# Altium schematic sheet CH32X035F8U6-R0.SchDoc
size 304 x 254 mm
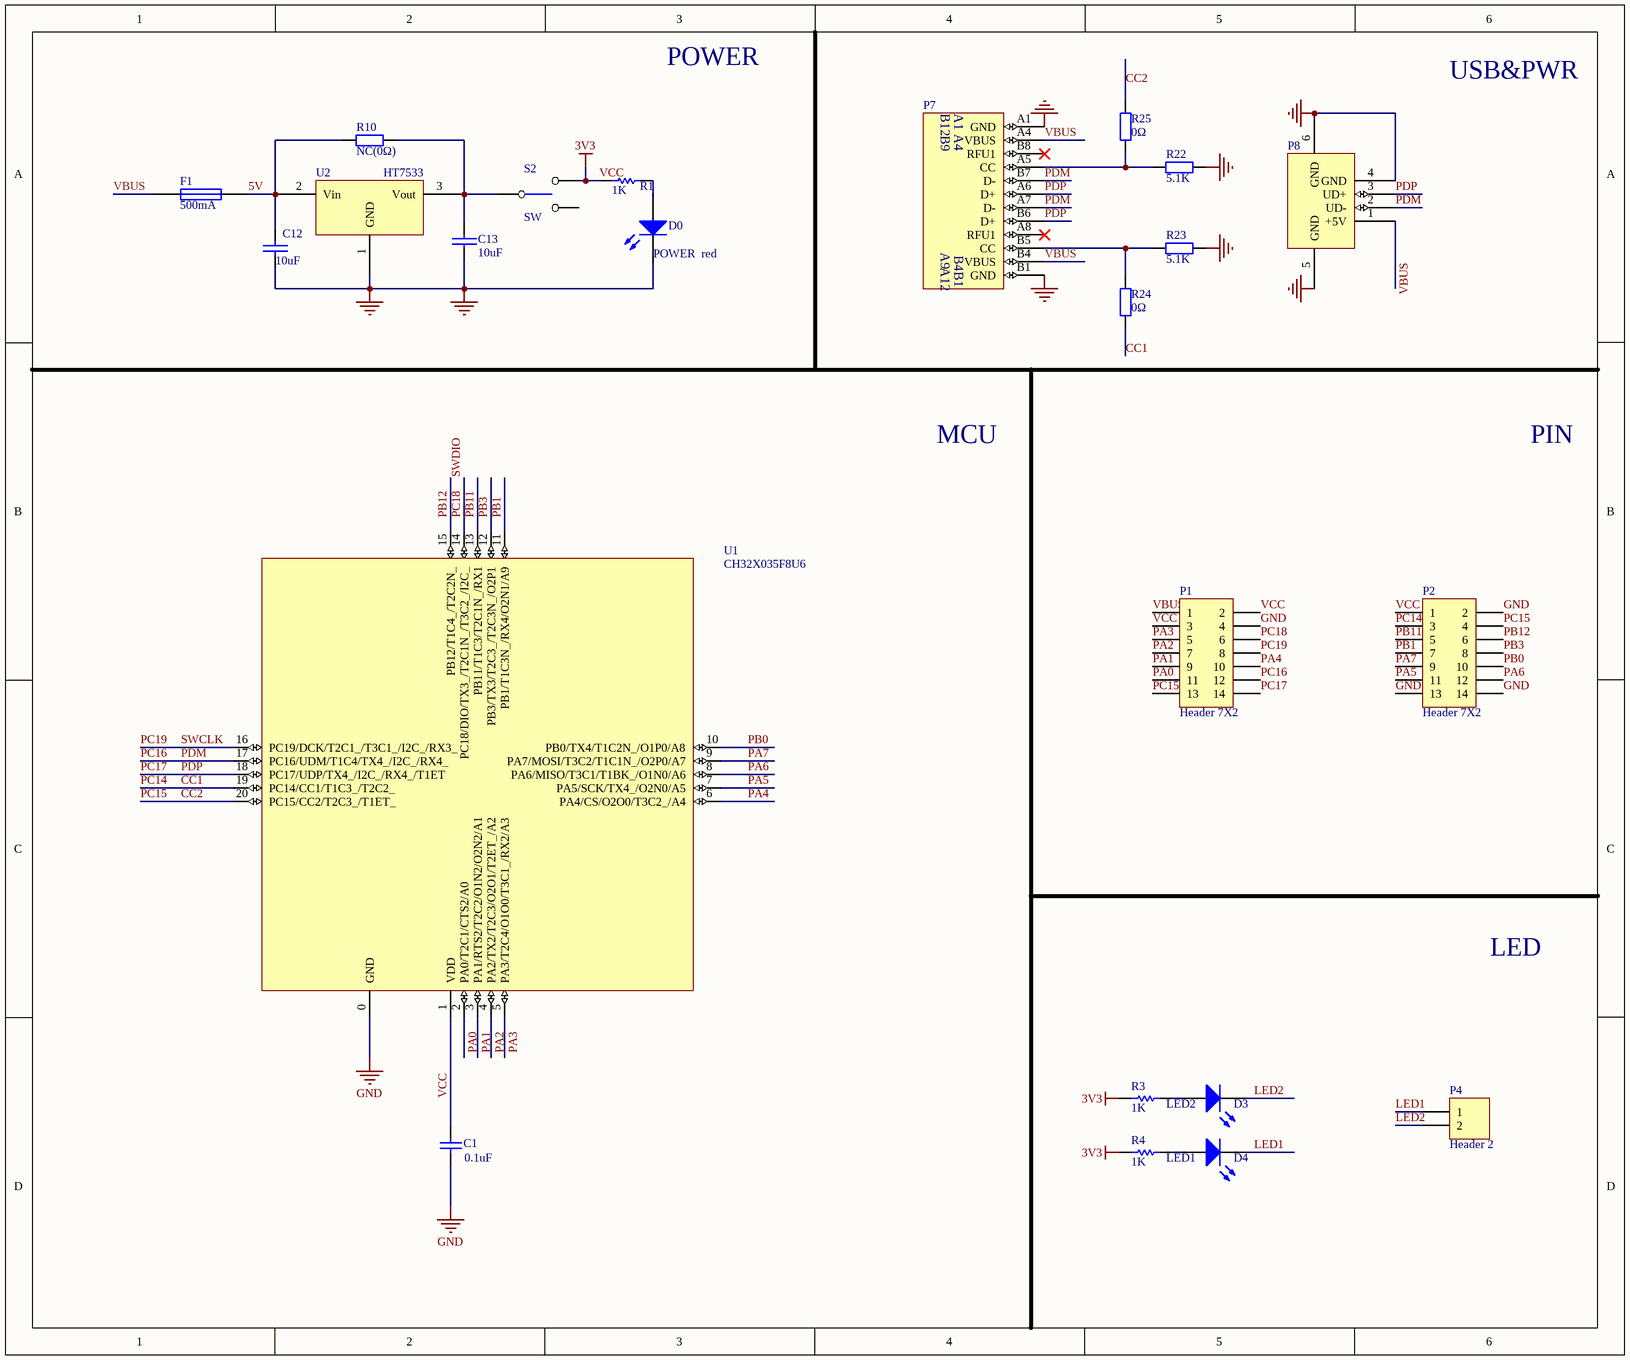
[diagram p0: CH32X035F8U6-R0.SchDoc]

## Parts
C1  0.1uF  [0603_C]
C12  10uF  [0603_C]
C13  10uF  [0603_C]
D0  POWER  red  [0603+]
D3  LED2  [0603+]
D4  LED1  [0603+]
F1  500mA  [0603]
P1  Header 7X2  [IDC14-2.54mm]
P2  Header 7X2  [IDC14-2.54mm]
P4  Header 2  [SIP2-2.54mm]
P7  TYPE-C  [TYPE-C-Receptacle-2.0]  (value not drawn)
P8  USB_A  [USBAF]  (value not drawn)
R1  1K  [0603]
R3  1K  [0603]
R4  1K  [0603]
R10  NC(0Ω)  [0603]
R22  5.1K  [0603]
R23  5.1K  [0603]
R24  0Ω  [0603]
R25  0Ω  [0603]
S2  SW  [SW1]
U1  CH32X035F8U6  [QFN20_3X3]
U2  HT7533  [SOT-89]

## Nets
GND: C1.1 C12.2 C13.2 D0.2(K) P1.4 P2.2 P2.13 P2.14 P7.A1(GND) P7.B1(GND) P8.4(GND) P8.5(GND) P8.6(GND) R22.2 R23.2 U1.0(GND) U2.1(GND)
VCC: C1.2 P1.2 P1.3 P2.1 R1.2 R3.1 R4.1 S2.3 U1.1(VDD)  [also labelled 3V3]
5V: C12.1 F1.2 R10.2 U2.2(Vin)
CC1: P2.3 R24.1 U1.19(PC14/CC1/T1C3_/T2C2_)  [also labelled PC14]
CC2: P1.13 P2.4 R25.2 U1.20(PC15/CC2/T2C3_/T1ET_)  [also labelled PC15]
LED1: D4.2(K) P4.1
LED2: D3.2(K) P4.2
PA0: P1.11 U1.2(PA0/T2C1/CTS2/A0)
PA1: P1.9 U1.3(PA1/RTS2/T2C2/O1N2/O2N2/A1)
PA2: P1.7 U1.4(PA2/TX2/T2C3/O2O1/T2ET_/A2)
PA3: P1.5 U1.5(PA3/T2C4/O1O0/T3C1_/RX2/A3)
PA4: P1.10 U1.6(PA4/CS/O2O0/T3C2_/A4)
PA5: P2.11 U1.7(PA5/SCK/TX4_/O2N0/A5)
PA6: P2.12 U1.8(PA6/MISO/T3C1/T1BK_/O1N0/A6)
PA7: P2.9 U1.9(PA7/MOSI/T3C2/T1C1N_/O2P0/A7)
PB0: P2.10 U1.10(PB0/TX4/T1C2N_/O1P0/A8)
PB1: P2.7 U1.11(PB1/T1C3N_/RX4/O2N1/A9)
PB3: P2.8 U1.12(PB3/TX3/T2C3_/T2C3N_/O2P1)
PB11: P2.5 U1.13(PB11/T1C3/T2C1N_/RX1)
PB12: P2.6 U1.15(PB12/T1C4_/T2C2N_)
PC16: P1.12 P7.A7(D-) P7.B7(D-) P8.2(UD-) U1.17(PC16/UDM/T1C4/TX4_/I2C_/RX4_)  [also labelled PDM]
PC17: P1.14 P7.A6(D+) P7.B6(D+) P8.3(UD+) U1.18(PC17/UDP/TX4_/I2C_/RX4_/T1ET)  [also labelled PDP]
PC18: P1.6 U1.14(PC18/DIO/TX3_/T2C1N_/T3C2_/I2C_)  [also labelled SWDIO]
PC19: P1.8 U1.16(PC19/DCK/T2C1_/T3C1_/I2C_/RX3_)  [also labelled SWCLK]
VBUS: F1.1 P1.1 P7.A4(VBUS) P7.B4(VBUS) P8.1(+5V)
NetC13_1: C13.1 R10.1 S2.1 U2.3(Vout)
NetD0_1: D0.1(A) R1.1
NetD3_1: D3.1(A) R3.2
NetD4_1: D4.1(A) R4.2
NetP7_A5: P7.A5(CC) R22.1 R25.1
NetP7_B5: P7.B5(CC) R23.1 R24.2

Not connected (* = marked no-connect by the designer): P7 A8(RFU1)* B8(RFU1)*; S2 2

## Notes on the sheet
- POWER
- USB&PWR
- MCU
- PIN
- LED
- (in symbol TYPE-C1) B12; B9; A9; A12

## Library data of the parts
C1 = Cap: Capacitor
C12 C13 = CAP: Capacitor
D0 D3 D4 = LED0: Typical INFRARED GaAs LED; Published: 8-Jun-2000; LatestRevisionDate: 08-Jul-2005; LatestRevisionNote: Mech Layer 1 removed.; PackageReference: LED-0; Publisher: Altium Limited
F1 = FUSE1: Fuse
P1 P2 = Header 7X2: Header, 7-Pin, Dual row; LatestRevisionDate: 17-Jul-2002; LatestRevisionNote: Re-released for DXP Platform.; Publisher: Altium Limited
P4 = Header 2: Header, 2-Pin; LatestRevisionDate: 17-Jul-2002; LatestRevisionNote: Re-released for DXP Platform.; Publisher: Altium Limited
P7 = TYPE-C1
P8 = USB: USB Port
R1 R3 R4 = Res Semi: Semiconductor Resistor; Published: 8-Jun-2000; LatestRevisionDate: 17-Jul-2002; LatestRevisionNote: Re-released for DXP Platform.; PackageReference: AXIAL-0.5; Publisher: Altium Limited; Value: 1K
R10 = Res2: Resistor; Value: 10K; Published: 8-Jun-2000; LatestRevisionDate: 17-Jul-2002; LatestRevisionNote: Re-released for DXP Platform.; PackageReference: AXIAL-0.4; Publisher: Altium Limited
R22-R25 = Res2: Resistor
U1 = CH32X035F8U6: RISC-V MCU with USB/PD/ADC/SPI/I2C/UART/OA
U2 = 1117-3.3V